# EAGLE schematic SPM (EAGLE 6.1)
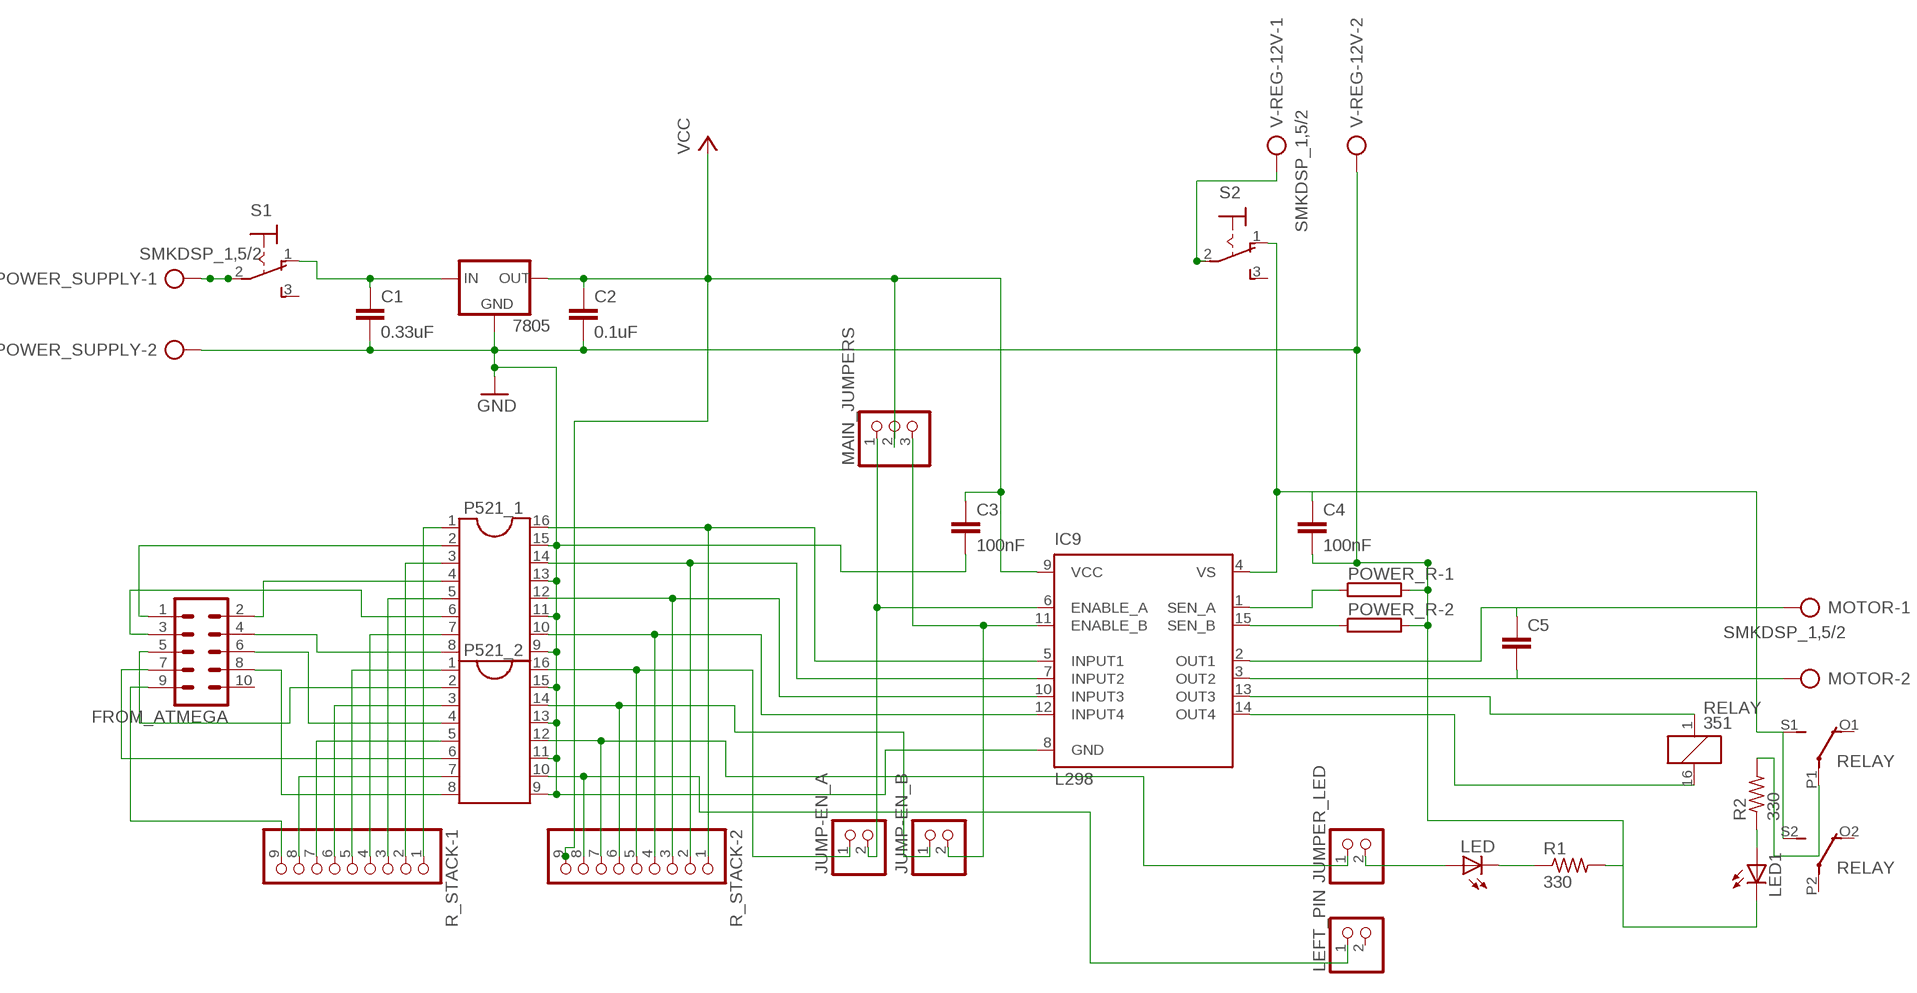
[diagram p0: schematic, sheet 1]

## Parts
7805  78XXS  [78XXS]
C1  0.33uF  C2,5-3  [C2.5-3]
C2  0.1uF  C2,5-3  [C2.5-3]
C3  100nF  C2,5-3  [C2.5-3]
C4  100nF  C2,5-3  [C2.5-3]
C5  C2,5-3  [C2.5-3]
FROM_ATMEGA  ML10  [ML10]
IC9  L298  [MULTIWATT-15]
JUMP-EN_A  PINHD-1X2  [1X02]
JUMP-EN_B  PINHD-1X2  [1X02]
JUMPER_LED  PINHD-1X2  [1X02]
LED  LED10MM  [LED10MM]
LED1  LED10MM  [LED10MM]
LEFT_PIN  PINHD-1X2  [1X02]
MAIN_JUMPERS  PINHD-1X3  [1X03]
MOTOR  SMKDSP_1,5/2  [SMKDSP_1,5/2]
P521_1  DIL16  [DIL16]
P521_2  DIL16  [DIL16]
POWER_R-1  RHPS932  [HPS932]
POWER_R-2  RHPS932  [HPS932]
POWER_SUPPLY  SMKDSP_1,5/2  [SMKDSP_1,5/2]
R1  330  R-US_0204/7  [0204/7]
R2  330  R-US_0204/7  [0204/7]
R_STACK-1  PINHD-1X9  [1X09]
R_STACK-2  PINHD-1X9  [1X09]
RELAY  351  [351]
S1  320-916  [320-916]
S2  320-916  [320-916]
V-REG-12V  SMKDSP_1,5/2  [SMKDSP_1,5/2]

## Nets
GND: 7805.GND C1.2 C2.2 C3.2 C4.2 IC9.8(GND) LED1.K(C) P521_1.9 P521_1.11 P521_1.13 P521_1.15 P521_2.9 P521_2.11 P521_2.13 P521_2.15 POWER_R-1.2 POWER_R-2.2 POWER_SUPPLY.2 R1.2 V-REG-12V.2
N$1: FROM_ATMEGA.1 P521_1.2
N$2: FROM_ATMEGA.2 P521_1.4
N$3: FROM_ATMEGA.3 P521_1.6
N$4: FROM_ATMEGA.4 P521_1.8
N$5: FROM_ATMEGA.5 P521_2.2
N$6: FROM_ATMEGA.6 P521_2.4
N$7: FROM_ATMEGA.7 P521_2.6
N$8: FROM_ATMEGA.8 P521_2.8
N$9: FROM_ATMEGA.9 R_STACK-1.9
N$10: P521_1.1 R_STACK-1.1
N$11: P521_1.3 R_STACK-1.2
N$12: P521_1.5 R_STACK-1.3
N$13: P521_1.7 R_STACK-1.4
N$14: P521_2.1 R_STACK-1.5
N$15: P521_2.3 R_STACK-1.6
N$16: P521_2.5 R_STACK-1.7
N$17: P521_2.7 R_STACK-1.8
N$18: C4.1 IC9.4(VS) RELAY.S1(2:S) RELAY.S2(3:S) S2.1(O)
N$19: JUMPER_LED.2 LED.A
N$20: IC9.5(INPUT1) P521_1.16 R_STACK-2.1
N$21: IC9.7(INPUT2) P521_1.14 R_STACK-2.2
N$22: IC9.10(INPUT3) P521_1.12 R_STACK-2.3
N$23: IC9.12(INPUT4) P521_1.10 R_STACK-2.4
N$24: JUMP-EN_A.1 P521_2.16 R_STACK-2.5
N$25: JUMP-EN_B.1 P521_2.14 R_STACK-2.6
N$26: JUMPER_LED.1 P521_2.12 R_STACK-2.7
N$27: LEFT_PIN.1 P521_2.10 R_STACK-2.8
N$28: C5.1 IC9.2(OUT1) MOTOR.1
N$29: C5.2 IC9.3(OUT2) MOTOR.2
N$30: IC9.13(OUT3) RELAY.1
N$31: IC9.11(ENABLE_B) JUMP-EN_B.2 MAIN_JUMPERS.3
N$32: IC9.6(ENABLE_A) JUMP-EN_A.2 MAIN_JUMPERS.1
N$33: IC9.14(OUT4) RELAY.16
N$34: LED.K(C) R1.1
N$35: IC9.1(SEN_A) POWER_R-1.1
N$36: IC9.15(SEN_B) POWER_R-2.1
N$37: 7805.IN C1.1 S1.1(O)
N$38: LED1.A R2.1
N$39: R2.2 RELAY.P1(2:P)
N$40: POWER_SUPPLY.1 S1.2(P)
N$41: S2.2(P) V-REG-12V.1
VCC: 7805.OUT C2.1 C3.1 IC9.9(VCC) MAIN_JUMPERS.2 R_STACK-2.9
Unconnected: FROM_ATMEGA.10 LEFT_PIN.2 RELAY.O1(2:O) RELAY.O2(3:O) RELAY.P2(3:P) S1.3(S) S2.3(S)

## Library data of the parts
7805 = v-reg:78XXS: VOLTAGE REGULATOR
C1-C5 = capacitor-wima:C: CAPACITOR naming: grid - package width
FROM_ATMEGA = con-harting-ml:ML10: HARTING; OC_FARNELL: unknown; OC_NEWARK: unknown
IC9 = st-microelectronics:L298: DUAL FULL-BRIDGE DRIVER; MPN: L298N; OC_FARNELL: 1589425; OC_NEWARK: 32M1527
JUMP-EN_A JUMP-EN_B JUMPER_LED LEFT_PIN = pinhead:PINHD-1X2: PIN HEADER
LED LED1 = led:LED: LED OSRAM: - CHIPLED LG R971, LG N971, LY N971, LG Q971, LY Q971, LO R971, LY R971 LH N974, LH R974 LS Q976, LO Q976, LY Q976 LO Q996 - Hyper CHIPLED LW Q18S LB Q993, LB Q99A, LB R99A - SideLED LS A670, LO A670, LY A670, LG A670, LP A670 LB A673, LV A673, LT A673, LW A673 LH A674 LY A675 LS A676, LA A676, LO A676, LY A676, LW A676 LS A679, LY A679, LG A679 - Hyper Micro SIDELED® LS Y876, LA Y876, LO Y876, LY Y876 LT Y87S - SmartLED LW L88C, LW L88S LB L89C, LB L89S, LG L890 LS L89K, LO L89K, LY L89K LS L896, LA L896, LO L896, LY L896 - TOPLED LS T670, LO T670, LY T670, LG T670, LP T670 LSG T670, LSP T670, LSY T670, LOP T670, LYG T670 LG T671, LOG T671, LSG T671 LB T673, LV T673, LT T673, LW T673 LH T674 LS T676, LA T676, LO T676, LY T676, LB T676, LH T676, LSB T676, LW T676 LB T67C, LV T67C, LT T67C, LS T67K, LO T67K, LY T67K, LW E67C LS E67B, LA E67B, LO E67B, LY E67B, LB E67C, LV E67C, LT E67C LW T67C LS T679, LY T679, LG T679 LS T770, LO T770, LY T770, LG T770, LP T770 LB T773, LV T773, LT T773, LW T773 LH T774 LS E675, LA E675, LY E675, LS T675 LS T776, LA T776, LO T776, LY T776, LB T776 LHGB T686 LT T68C, LB T68C - Hyper Mini TOPLED® LB M676 - Mini TOPLED Santana® LG M470 LS M47K, LO M47K, LY M47K Source: http://www.osram.convergy.de LUXEON: - LUMILED® LXK2-PW12-R00, LXK2-PW12-S00, LXK2-PW14-U00, LXK2-PW14-V00 LXK2-PM12-R00, LXK2-PM12-S00, LXK2-PM14-U00 LXK2-PE12-Q00, LXK2-PE12-R00, LXK2-PE12-S00, LXK2-PE14-T00, LXK2-PE14-U00 LXK2-PB12-K00, LXK2-PB12-L00, LXK2-PB12-M00, LXK2-PB14-N00, LXK2-PB14-P00, LXK2-PB14-Q00 LXK2-PR12-L00, LXK2-PR12-M00, LXK2-PR14-Q00, LXK2-PR14-R00 LXK2-PD12-Q00, LXK2-PD12-R00, LXK2-PD12-S00 LXK2-PH12-R00, LXK2-PH12-S00 LXK2-PL12-P00, LXK2-PL12-Q00, LXK2-PL12-R00 Source: www.luxeon.com KINGBRIGHT: KA-3528ASYC Source: www.kingbright.com
MAIN_JUMPERS = pinhead:PINHD-1X3: PIN HEADER
MOTOR POWER_SUPPLY V-REG-12V = con-phoenix-smkdsp:SMKDSP_1,5/2: Printklemme, Nennstrom: 17,5 A, Bemessungsspannung: 250 V, Raster: 5,0 mm Source: http://eshop.phoenixcontact.de .. 1733415.pdf; MF: FARNELL; MPN: 1733570; OC_FARNELL: 3041244; OC_NEWARK: 69C8588
P521_1 P521_2 = ic-package:DIL16: Dual In Line / Socket
POWER_R-1 POWER_R-2 = resistor-power:R: Power Resitor; OC_FARNELL: unknown; OC_NEWARK: unknown
R1 R2 = resistor:R-US_: RESISTOR, American symbol
R_STACK-1 R_STACK-2 = pinhead:PINHD-1X9: PIN HEADER
RELAY = relay:351: RELAY 2 x switch, Omron; OC_FARNELL: unknown; OC_NEWARK: unknown
S1 S2 = switch:320-916: TOGGLE SWITCH distributor RS Components